# EAGLE design generic_midi_1 (EAGLE 6.4)
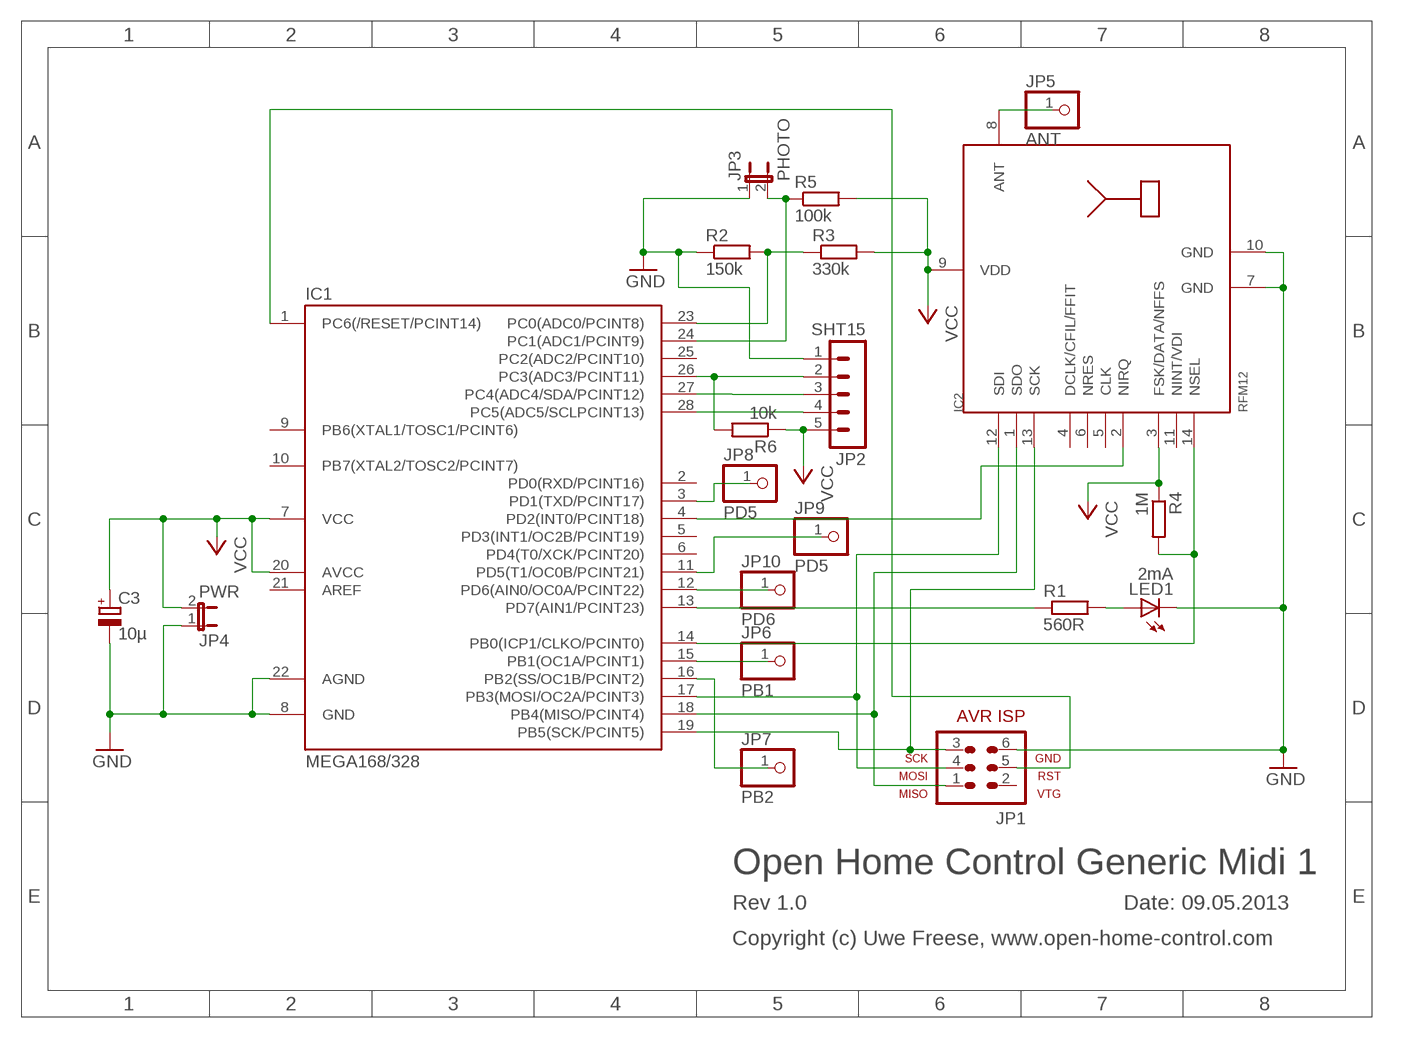
[diagram p0: schematic, sheet 1]

## Parts
C3  10µ  CPOL-EUE1.8-4  [E1,8-4]
IC1  MEGA168/328  MEGA48/88/168-PU  [DIL28-3]
IC2  RFM12  [RFM]
JP1  AVR-ISP-6  [AVR-ISP-6]
JP2  SHT15  MA05-1  [MA05-1]
JP3  PHOTO  JP1E  [JP1]
JP4  PWR  JP1E  [JP1]
JP5  ANT  PINHD-1X1  [1X01]
JP6  PB1  PINHD-1X1  [1X01]
JP7  PB2  PINHD-1X1  [1X01]
JP8  PD5  PINHD-1X1  [1X01]
JP9  PD5  PINHD-1X1  [1X01]
JP10  PD6  PINHD-1X1  [1X01]
LED1  2mA  LED3MM  [LED3MM]
R1  560R  R-EU_0207/7  [0207/7]
R2  150k  R-EU_0207/7  [0207/7]
R3  330k  R-EU_0207/7  [0207/7]
R4  1M  R-EU_0207/7  [0207/7]
R5  100k  R-EU_0207/7  [0207/7]
R6  10k  R-EU_0207/7  [0207/7]

## Nets
GND: C3.- IC1.8(GND) IC1.22(AGND) IC2.7(GND) IC2.10(GND) JP1.6 JP2.1 JP3.1 JP4.1 LED1.K(C) R2.1
N$1: IC1.24(PC1(ADC1/PCINT9)) JP3.2 R5.1
N$3: IC1.17(PB3(MOSI/OC2A/PCINT3)) IC2.12(SDI) JP1.4
N$4: IC1.18(PB4(MISO/PCINT4)) IC2.1(SDO) JP1.1
N$5: IC1.19(PB5(SCK/PCINT5)) IC2.13(SCK) JP1.3
N$6: IC1.13(PD7(AIN1/PCINT23)) R1.1
N$7: IC1.27(PC4(ADC4/SDA/PCINT12)) JP2.3
N$8: IC1.1(PC6(/RESET/PCINT14)) JP1.5
N$9: IC1.28(PC5(ADC5/SCLPCINT13)) JP2.4
N$10: IC1.26(PC3(ADC3/PCINT11)) JP2.2 R6.2
N$11: IC2.8(ANT) JP5.1
N$12: LED1.A R1.2
N$13: IC1.14(PB0(ICP1/CLKO/PCINT0)) IC2.14(NSEL) R4.2
N$14: IC1.11(PD5(T1/OC0B/PCINT21)) JP9.1
N$15: IC1.4(PD2(INT0/PCINT18)) IC2.2(NIRQ)
N$16: IC1.12(PD6(AIN0/OC0A/PCINT22)) JP10.1
N$17: IC1.15(PB1(OC1A/PCINT1)) JP6.1
N$18: IC1.23(PC0(ADC0/PCINT8)) R2.2 R3.1
N$19: IC1.16(PB2(SS/OC1B/PCINT2)) JP7.1
N$20: IC1.3(PD1(TXD/PCINT17)) JP8.1
VCC: C3.+ IC1.7(VCC) IC1.20(AVCC) IC2.3(FSK/DATA/NFFS) IC2.9(VDD) JP2.5 JP4.2 R3.2 R4.1 R5.2 R6.1
Unconnected: IC1.2(PD0(RXD/PCINT16)) IC1.5(PD3(INT1/OC2B/PCINT19)) IC1.6(PD4(T0/XCK/PCINT20)) IC1.9(PB6(XTAL1/TOSC1/PCINT6)) IC1.10(PB7(XTAL2/TOSC2/PCINT7)) IC1.21(AREF) IC1.25(PC2(ADC2/PCINT10)) IC2.4(DCLK/CFIL/FFIT) IC2.5(CLK) IC2.6(NRES) IC2.11(NINT/VDI) JP1.2

## Notes on the sheet
- Open Home Control Generic Midi 1
- Rev 1.0 | Date: 09.05.2013
- Copyright (c) Uwe Freese, www.open-home-control.com

## Library data of the parts
C3 = rcl:CPOL-EU: POLARIZED CAPACITOR, European symbol
IC1 = avr-5-4.16:MEGA48/88/168-PU
IC2 = hopeRF:RFM12
JP1 = avr-5-4.16:AVR-ISP-6: AVR ISP-6 Serial Programming Header
JP2 = con-lstb:MA05-1: PIN HEADER; OC_FARNELL: unknown; OC_NEWARK: unknown
JP3 JP4 = jumper:JP1E: JUMPER
JP5-JP10 = pinhead:PINHD-1X1: PIN HEADER
LED1 = led:LED: LED OSRAM: - CHIPLED LG R971, LG N971, LY N971, LG Q971, LY Q971, LO R971, LY R971 LH N974, LH R974 LS Q976, LO Q976, LY Q976 LO Q996 - Hyper CHIPLED LW Q18S LB Q993, LB Q99A, LB R99A - SideLED LS A670, LO A670, LY A670, LG A670, LP A670 LB A673, LV A673, LT A673, LW A673 LH A674 LY A675 LS A676, LA A676, LO A676, LY A676, LW A676 LS A679, LY A679, LG A679 - Hyper Micro SIDELED® LS Y876, LA Y876, LO Y876, LY Y876 LT Y87S - SmartLED LW L88C, LW L88S LB L89C, LB L89S, LG L890 LS L89K, LO L89K, LY L89K LS L896, LA L896, LO L896, LY L896 - TOPLED LS T670, LO T670, LY T670, LG T670, LP T670 LSG T670, LSP T670, LSY T670, LOP T670, LYG T670 LG T671, LOG T671, LSG T671 LB T673, LV T673, LT T673, LW T673 LH T674 LS T676, LA T676, LO T676, LY T676, LB T676, LH T676, LSB T676, LW T676 LB T67C, LV T67C, LT T67C, LS T67K, LO T67K, LY T67K, LW E67C LS E67B, LA E67B, LO E67B, LY E67B, LB E67C, LV E67C, LT E67C LW T67C LS T679, LY T679, LG T679 LS T770, LO T770, LY T770, LG T770, LP T770 LB T773, LV T773, LT T773, LW T773 LH T774 LS E675, LA E675, LY E675, LS T675 LS T776, LA T776, LO T776, LY T776, LB T776 LHGB T686 LT T68C, LB T68C - Hyper Mini TOPLED® LB M676 - Mini TOPLED Santana® LG M470 LS M47K, LO M47K, LY M47K Source: http://www.osram.convergy.de LUXEON: - LUMILED® LXK2-PW12-R00, LXK2-PW12-S00, LXK2-PW14-U00, LXK2-PW14-V00 LXK2-PM12-R00, LXK2-PM12-S00, LXK2-PM14-U00 LXK2-PE12-Q00, LXK2-PE12-R00, LXK2-PE12-S00, LXK2-PE14-T00, LXK2-PE14-U00 LXK2-PB12-K00, LXK2-PB12-L00, LXK2-PB12-M00, LXK2-PB14-N00, LXK2-PB14-P00, LXK2-PB14-Q00 LXK2-PR12-L00, LXK2-PR12-M00, LXK2-PR14-Q00, LXK2-PR14-R00 LXK2-PD12-Q00, LXK2-PD12-R00, LXK2-PD12-S00 LXK2-PH12-R00, LXK2-PH12-S00 LXK2-PL12-P00, LXK2-PL12-Q00, LXK2-PL12-R00 Source: www.luxeon.com KINGBRIGHT: KA-3528ASYC Source: www.kingbright.com
R1-R6 = rcl:R-EU_: RESISTOR, European symbol

## Net classes
0 default: clearance 0.305 mm

## Board
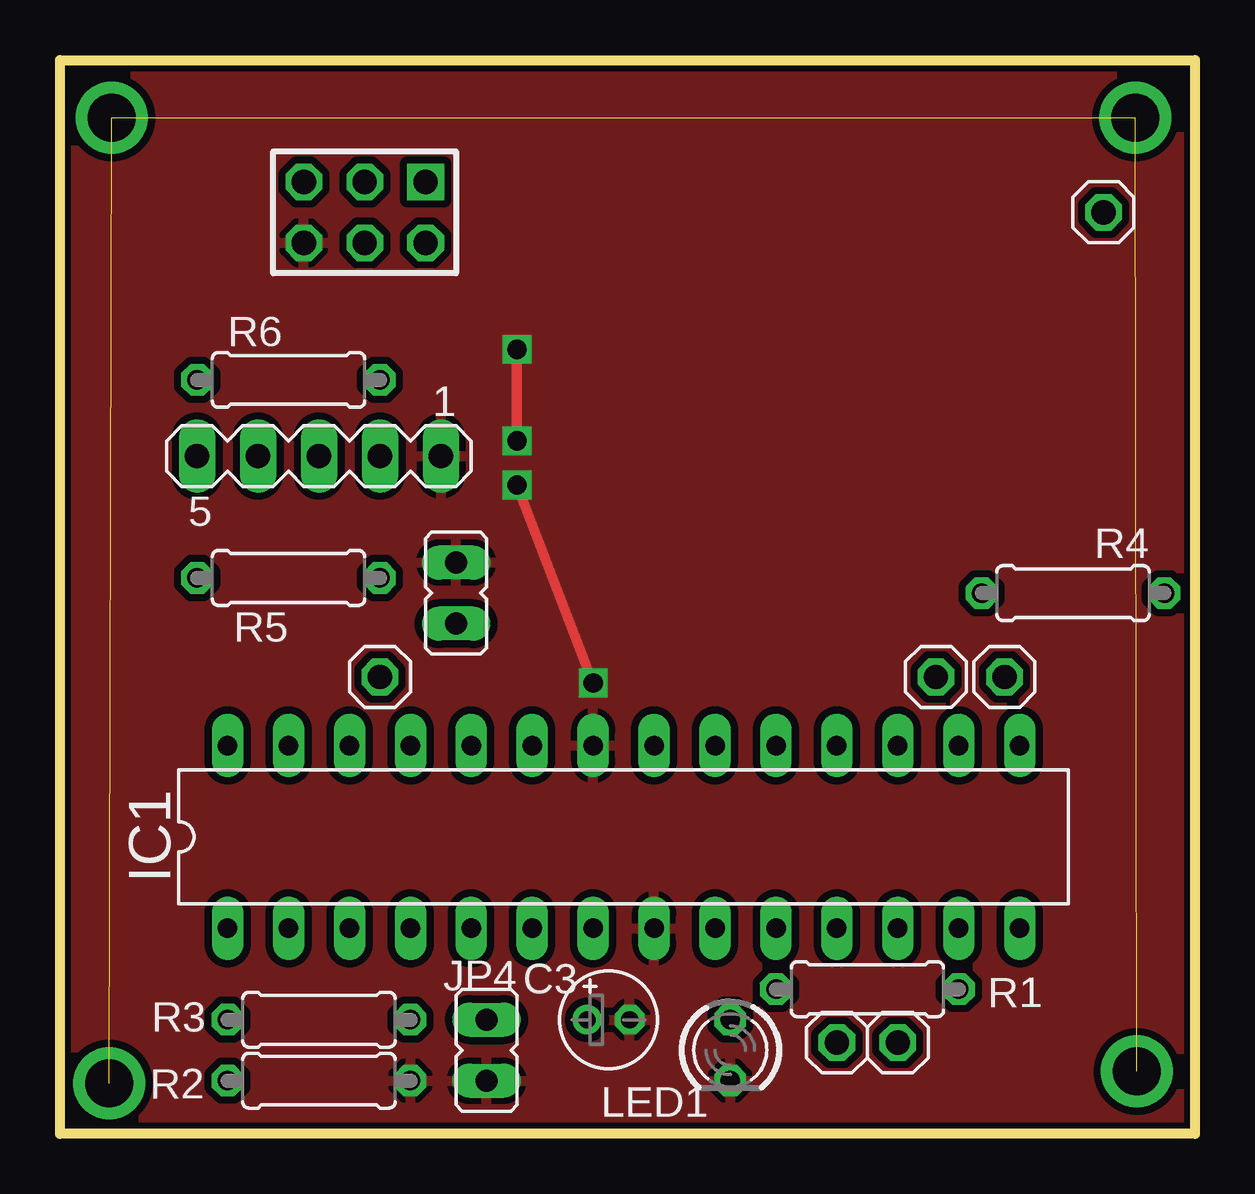
[diagram p1: board, top side]
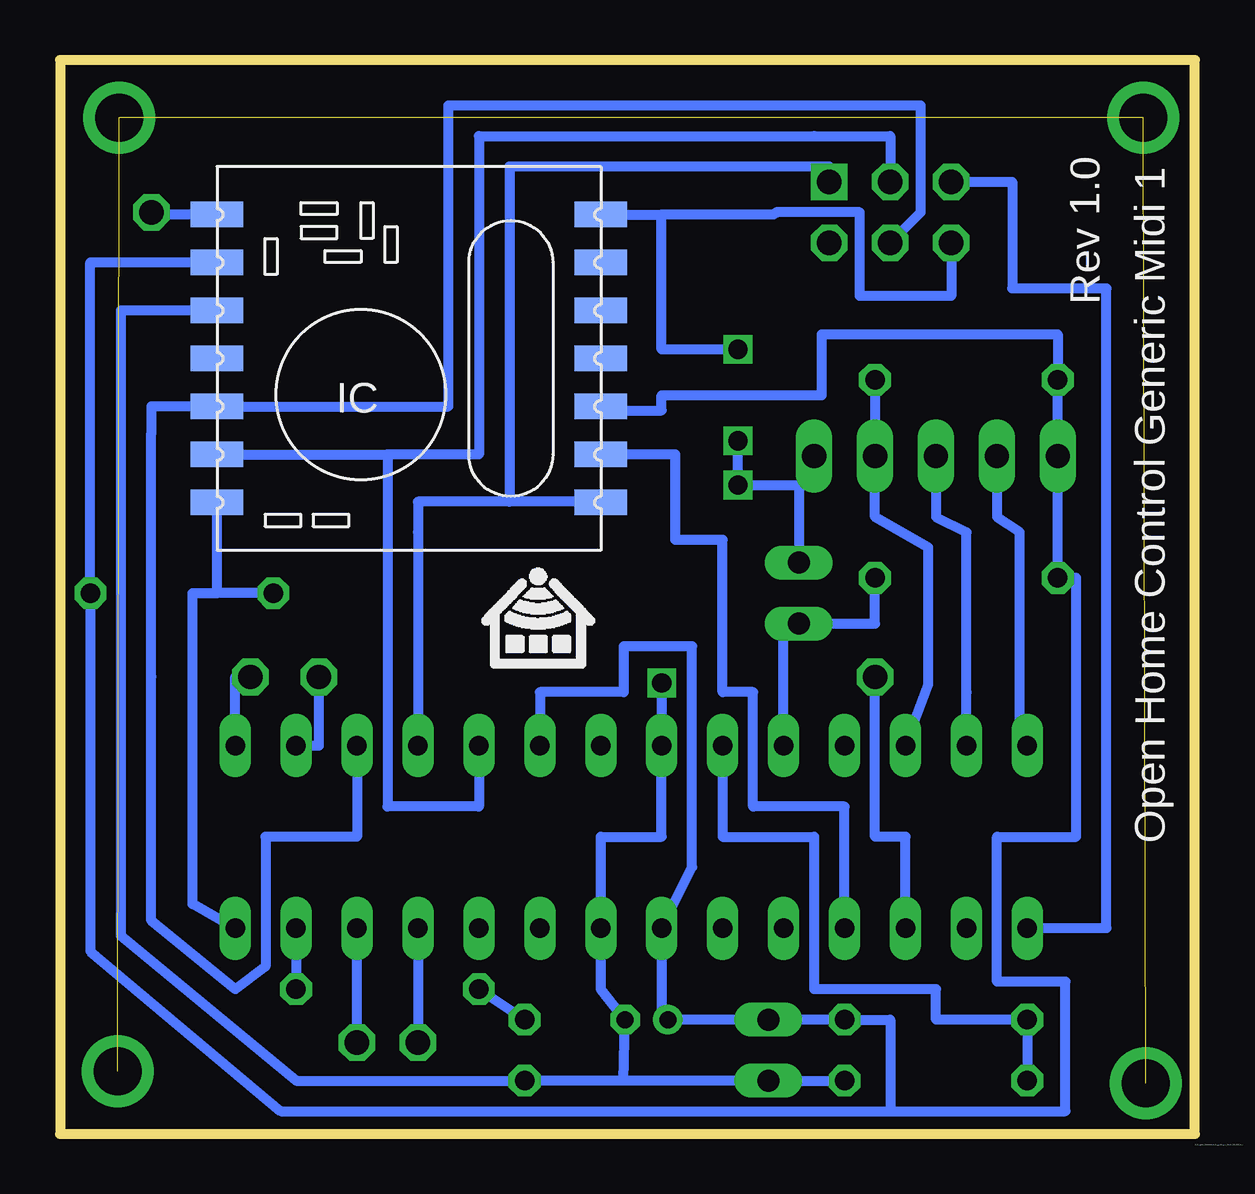
[diagram p2: board, bottom side, seen from below]

Size 47.31 x 44.77 mm. Coordinates in mm from the lower left corner, seen from the top.
Outline: 0,0 0,44.77 47.31,44.77 47.31,0 0,0
Copper layers (1*16): Top 0.035mm / dielectric 1.5mm / Bottom 0.035mm
Design rules "Fusion_eagle_rule_v1.1": minimum track width 6mil, minimum drill 12mil, track to track 6mil, track to pad 6mil, pad to pad 6mil, via to via 6mil, smd to smd 0mil, copper to edge 10mil, drill to drill 10mil, minimum pad ring 10mil, minimum via ring 6mil, stop-mask expansion 2mil, vias tented up to drill 100mil, thermal gap 10mil

### Footprints (pad centres in the part's own frame; a part is rotated, then mirrored left to right if it is on the bottom)
E1,8-4 = drill 0.711 pad 1.168: + -0.889,0 | drill 0.711 pad 1.168 octagon: - 0.889,0
DIL28-3 = drill 0.813 long: 1 -16.51,-3.81; 2 -13.97,-3.81; 3 -11.43,-3.81; 4 -8.89,-3.81; 5 -6.35,-3.81; 6 -3.81,-3.81; 7 -1.27,-3.81; 8 1.27,-3.81; 9 3.81,-3.81; 10 6.35,-3.81; 11 8.89,-3.81; 12 11.43,-3.81; 13 13.97,-3.81; 14 16.51,-3.81; 15 16.51,3.81; 16 13.97,3.81; 17 11.43,3.81; 18 8.89,3.81; 19 6.35,3.81; 20 3.81,3.81; 21 1.27,3.81; 22 -1.27,3.81; 23 -3.81,3.81; 24 -6.35,3.81; 25 -8.89,3.81; 26 -11.43,3.81; 27 -13.97,3.81; 28 -16.51,3.81
RFM = smd 2.184 x 1.067: 1 0,14; 2 0,12; 3 0,10; 4 0,8; 5 0,6; 6 0,4; 7 0,2; 8 16,2; 9 16,4; 10 16,6; 11 16,8; 12 16,10; 13 16,12; 14 16,14
AVR-ISP-6 = drill 1.016 square: 1 -2.54,-1.27 | drill 1.016 octagon: 2 -2.54,1.27; 3 0,-1.27; 4 0,1.27; 5 2.54,-1.27; 6 2.54,1.27
MA05-1 = drill 1.016 long: 1 -5.08,0; 2 -2.54,0; 3 0,0; 4 2.54,0; 5 5.08,0
JP1 = drill 0.914 long: 1 0,-1.27; 2 0,1.27
1X01 = drill 1.016 octagon: 1 0,0
LED3MM = drill 0.813 octagon: A -1.27,0; K 1.27,0
0207/7 = drill 0.813 octagon: 1 -3.81,0; 2 3.81,0

### Placement (x,y rotation side)
C3  22.86,4.76 0 top
IC1  23.5,12.38 0 top
IC2  24.77,40.32 180 bottom
JP1  12.7,38.42 180 top
JP2  10.79,28.26 180 top
JP3  16.51,22.54 180 top
JP4  17.78,3.49 0 top
JP5  43.5,38.42 0 top
JP6  39.37,19.05 0 top
JP7  36.51,19.05 0 top
JP8  13.34,19.05 0 top
JP9  32.38,3.81 0 top
JP10  34.92,3.81 0 top
LED1  27.94,3.49 270 top
R1  33.66,6.03 180 top
R2  10.79,2.22 180 top
R3  10.79,4.76 0 top
R4  42.23,22.54 180 top
R5  9.53,23.18 180 top
R6  9.53,31.43 0 top

### Tracks (layer width: path | path; a pad name or v marks a point on that pad's centre or on a via)
GND  (via drill 0.8)
  Top 0.406: v22.23,18.8 v19.05,27.05 | v19.05,28.89 v19.05,32.7
  Bottom 0.406: 23.81,2.22 C3.- 24.77,6.03 IC1.8 24.77,12.38 22.23,12.38 IC1.22 v22.23,18.8 | JP2.1 16.51,26.99 | 16.51,26.99 JP3.1 | v19.05,32.7 22.23,32.7 22.23,38.32 | IC2.10 44.77,34.32 44.77,8.25 37.47,2.22 LED1.K 23.81,2.22 | 23.81,2.22 JP4.1 R2.1 | IC2.7 22.23,38.32 | 19.05,26.99 v19.05,27.05 | v19.05,27.05 v19.05,28.89 | v19.05,27.05 16.51,27.05 16.51,26.99 | JP1.6 10.16,34.92 13.97,34.92 13.97,38.42 17.46,38.42 17.56,38.32 22.23,38.32
  pour Top: 0,-0.32 0,45.09 47.94,45.09 47.94,-0.32
N$1
  Bottom 0.406: IC1.24 17.14,21.27 JP3.2 13.34,21.27 R5.1
N$2  (via drill 2)  (3 unrouted)
  other vias: 2.16,42.35 44.83,42.35 44.89,2.6 2.05,2.12
N$3
  Bottom 0.406: IC1.17 34.92,12.38 38.73,12.38 38.73,6.99 40.01,6.03 43.5,8.89 43.5,19.05 43.5,29.21 43.5,30.32 IC2.12 31.11,30.32 31.11,42.86 11.43,42.86 11.43,38.42 JP1.4
N$4
  Bottom 0.406: JP1.1 15.24,40.32 28.57,40.32 28.57,26.35 | 28.57,26.35 32.38,26.35 32.38,25.08 IC1.18 | IC2.1 24.77,26.35 28.57,26.35
N$5
  Bottom 0.406: IC1.19 29.84,13.65 33.66,13.65 33.66,28.32 | JP1.3 12.7,41.59 15.88,41.59 29.84,41.59 29.84,28.32 33.66,28.32 | IC2.13 33.66,28.32
N$6
  Bottom 0.406: IC1.13 R1.1
N$7
  Bottom 0.406: IC1.27 9.53,18.42 9.53,25.08 10.79,25.72 JP2.3
N$8
  Bottom 0.406: JP1.5 7.62,39.69 7.62,35.24 3.68,35.24 3.68,8.57 IC1.1
N$9
  Bottom 0.406: IC1.28 7.3,16.26 7.3,19.75 7.3,25.08 8.26,25.72 JP2.4
N$10
  Bottom 0.406: IC1.26 11.11,18.73 11.11,24.45 13.34,25.72 JP2.2 R6.2
N$11
  Bottom 0.406: IC2.8 43.5,38.32 JP5.1
N$12
  Bottom 0.406: LED1.A R1.2
N$13
  Bottom 0.406: IC1.14 41.78,9.59 41.78,18.73 41.78,22.54 40.77,22.54 | R4.2 40.77,22.54 | 40.77,22.54 IC2.14
N$14
  Bottom 0.406: IC1.11 JP9.1
N$15
  Bottom 0.406: IC1.4 14.61,13.65 18.41,13.65 18.41,18.42 19.68,18.42 19.68,24.76 21.66,24.76 21.66,28.32 IC2.2
N$16
  Bottom 0.406: JP10.1 IC1.12
N$17
  Bottom 0.406: IC1.15 40.01,19.05 JP6.1
N$18
  Bottom 0.406: IC1.23 19.68,12.38 15.88,12.38 15.88,6.03 10.79,6.03 10.79,4.76 R3.1 R2.2
N$19
  Bottom 0.406: IC1.16 36.51,16.19 JP7.1
N$20
  Bottom 0.406: IC1.3 12.06,12.38 13.34,12.38 JP8.1
VCC
  Bottom 0.406: IC2.3 24.77,30.16 22.23,30.16 22.23,30.8 15.56,30.8 15.56,33.34 5.71,33.34 R6.1 JP2.5 5.71,23.3 4.95,23.18 | IC2.9 46.04,36.32 R4.1 46.04,7.62 38.1,0.95 12.7,0.95 | 4.95,23.18 4.95,12.38 8.26,12.38 8.26,6.35 5.4,6.35 5.4,0.95 12.7,0.95 | 4.95,23.18 R5.2 | 12.7,0.95 12.7,4.76 R3.2 JP4.2 C3.+ 22.23,4.76 IC1.7 20.95,11.11 20.95,20.32 23.81,20.32 23.81,18.42 27.3,18.42 IC1.20

### Text on the board
bNames: Open Home Control Generic Midi 1 | Rev 1.0 | D:/Eigene Dateien/ohc/logo/logo_black 150x133.bmp